# EAGLE board controller (EAGLE 8.2.1), part 1 of 2
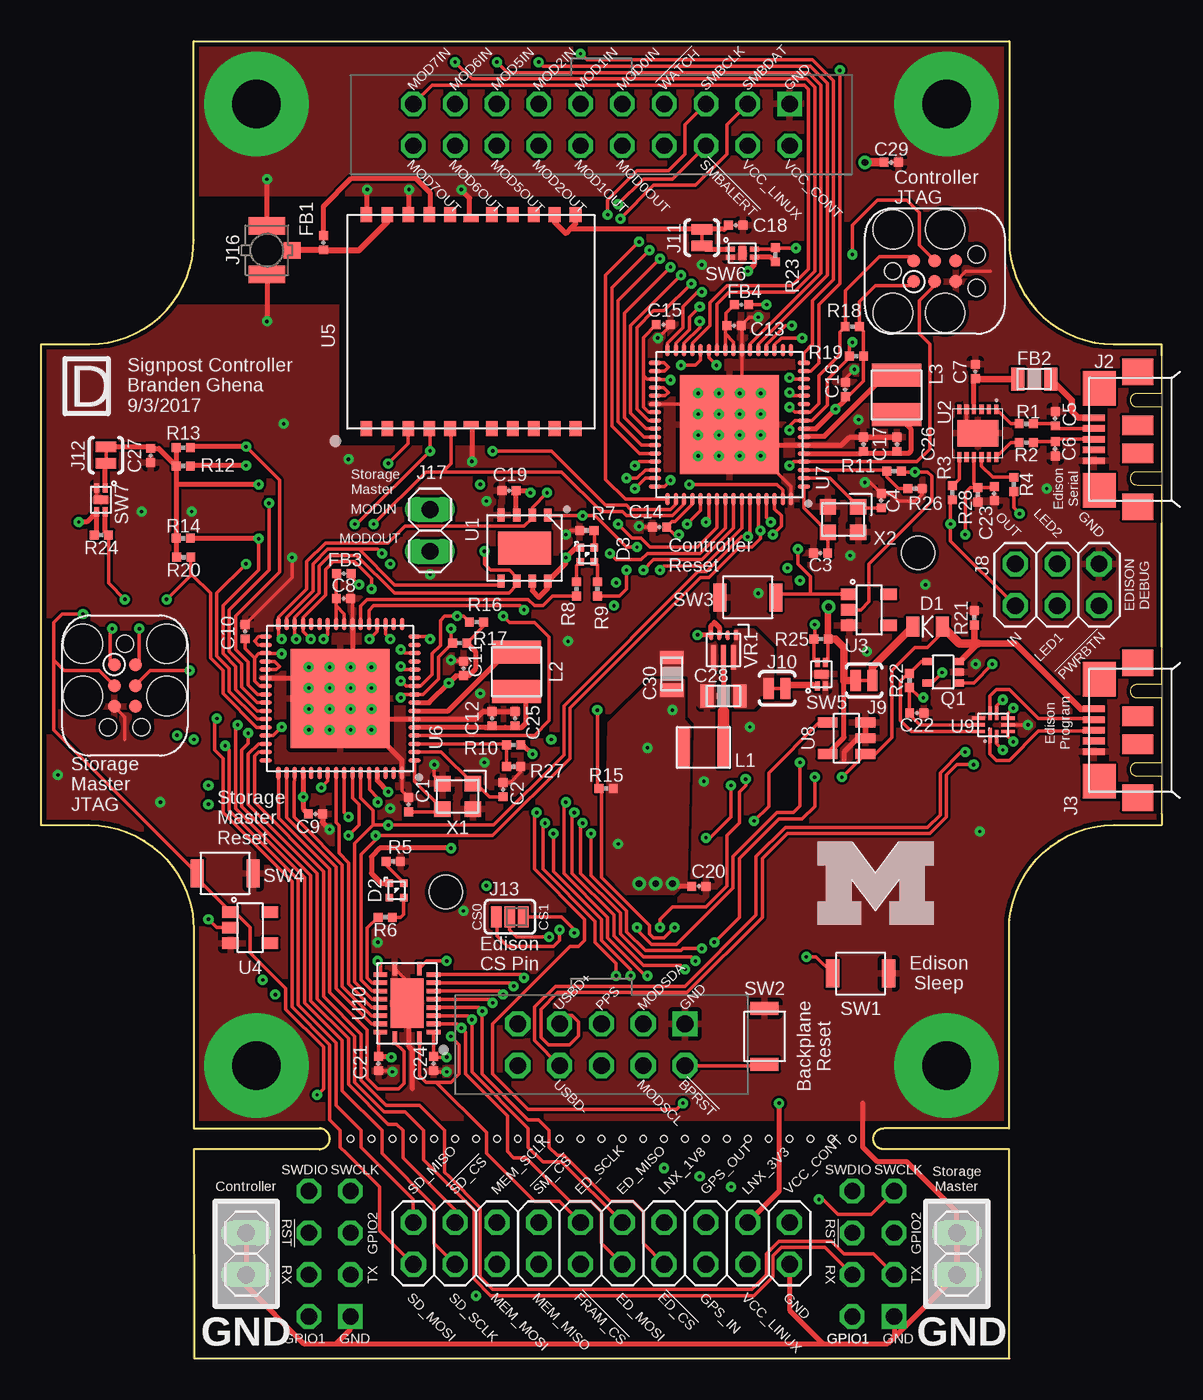
[diagram p5: board, top side]
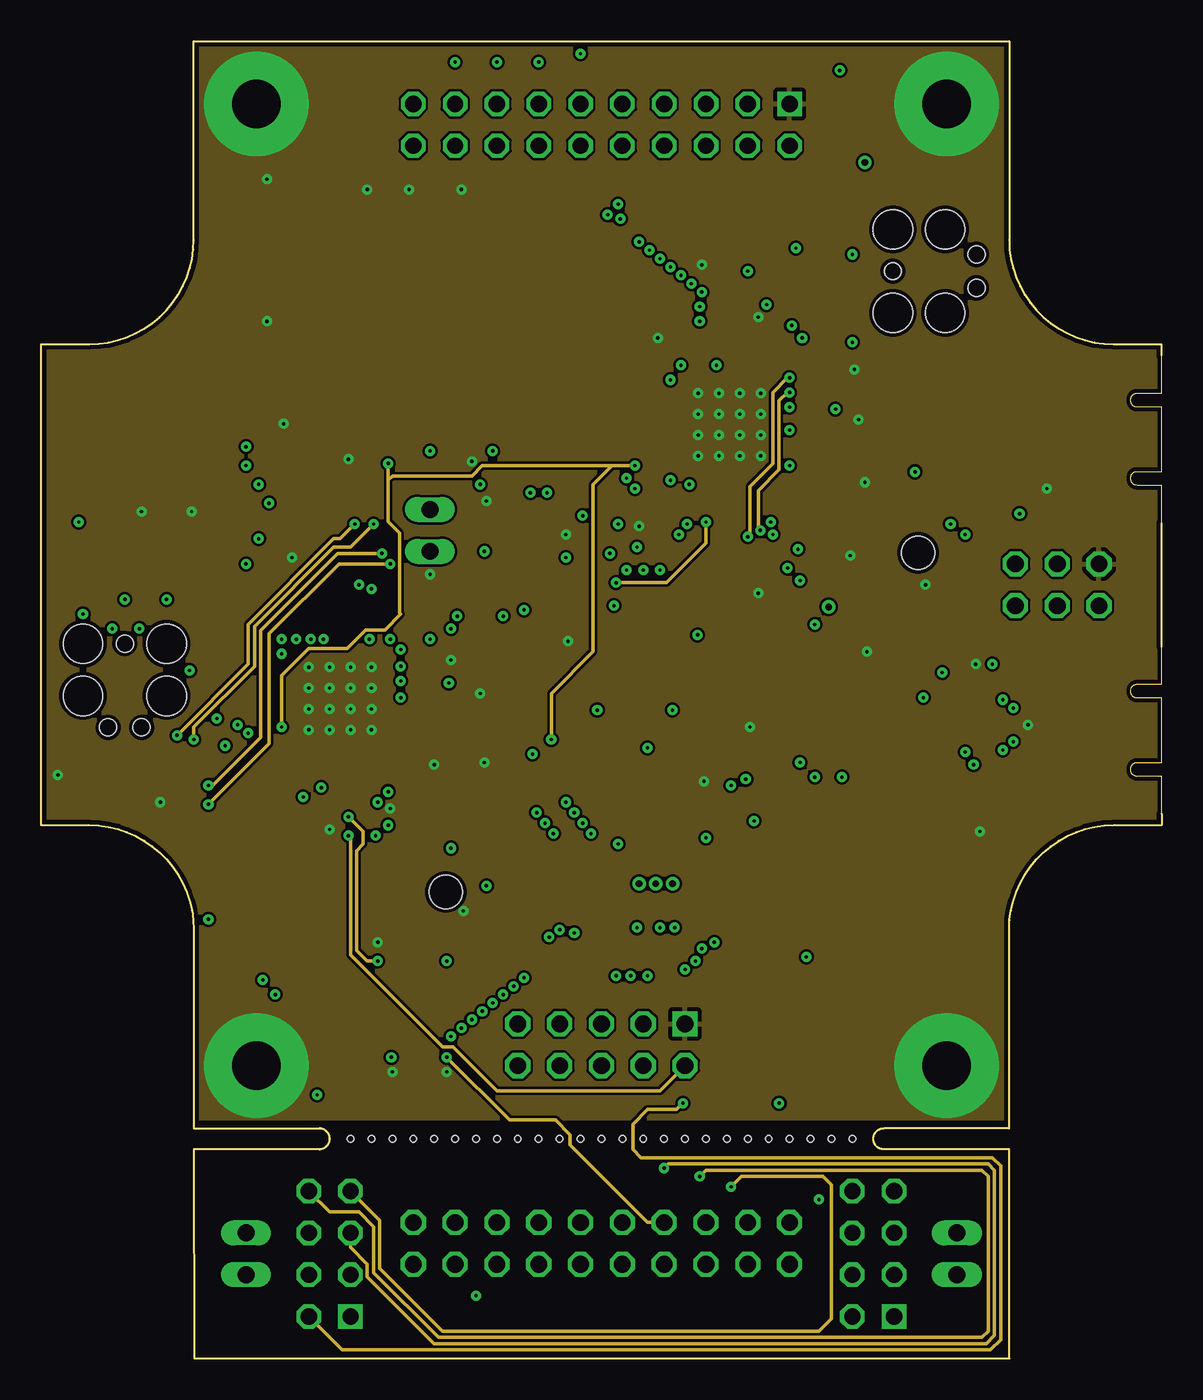
[diagram p6: board, inner layer Route2]
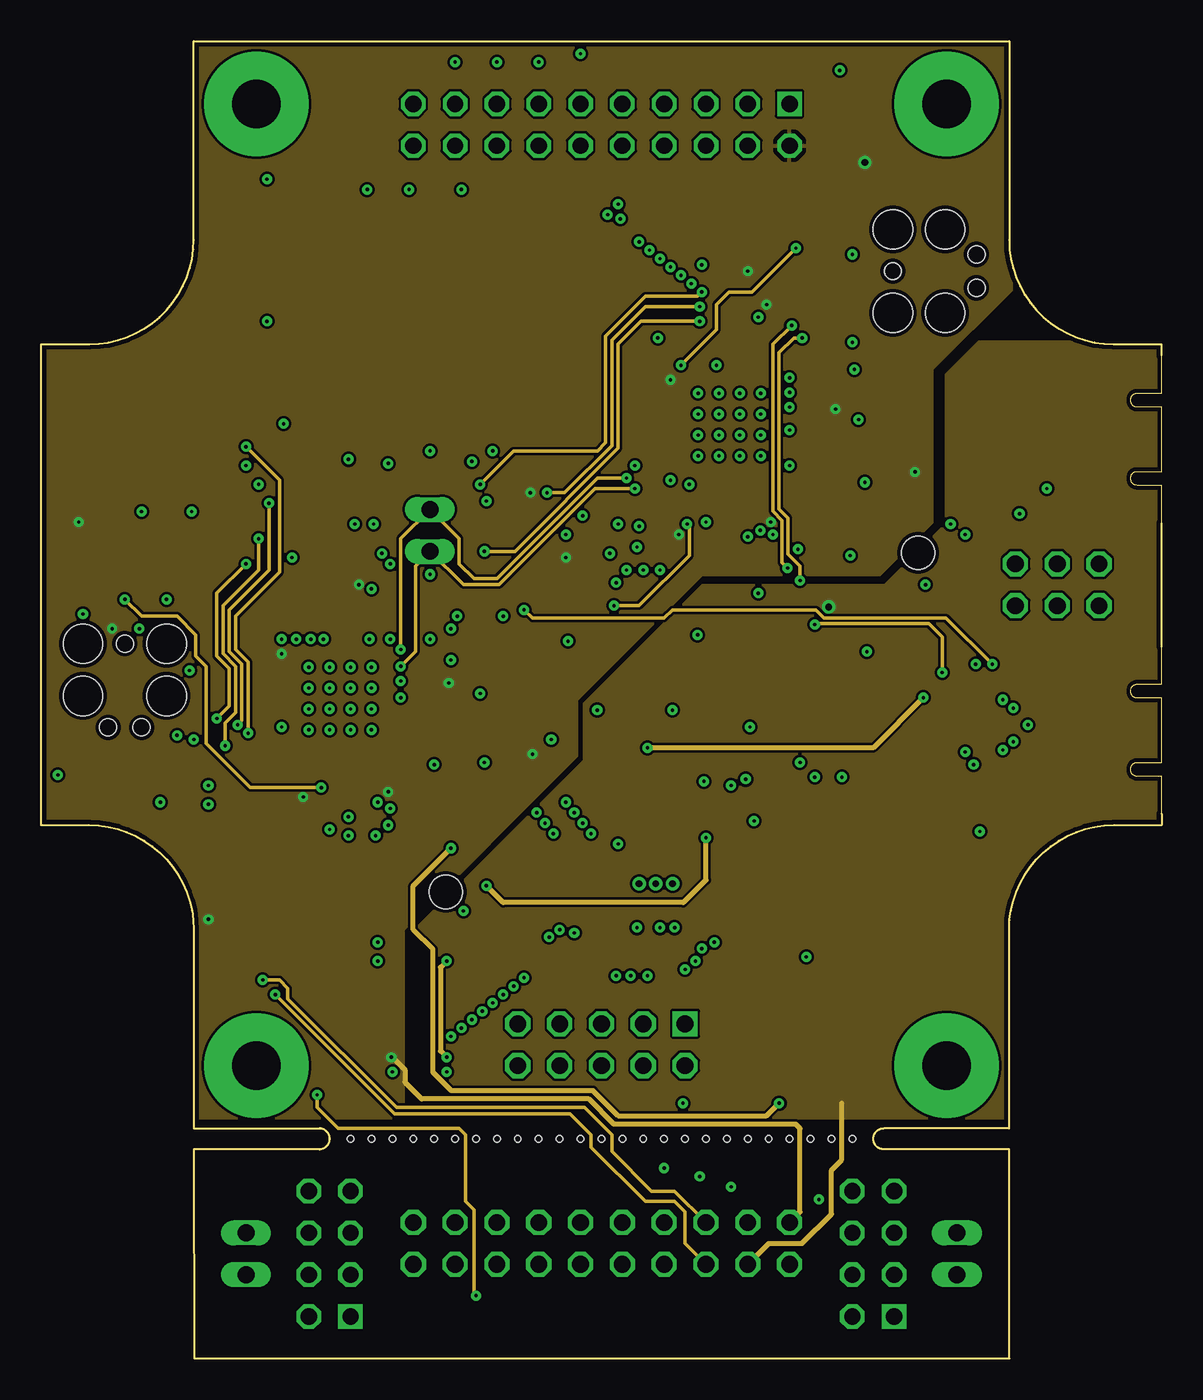
[diagram p7: board, inner layer Route15]
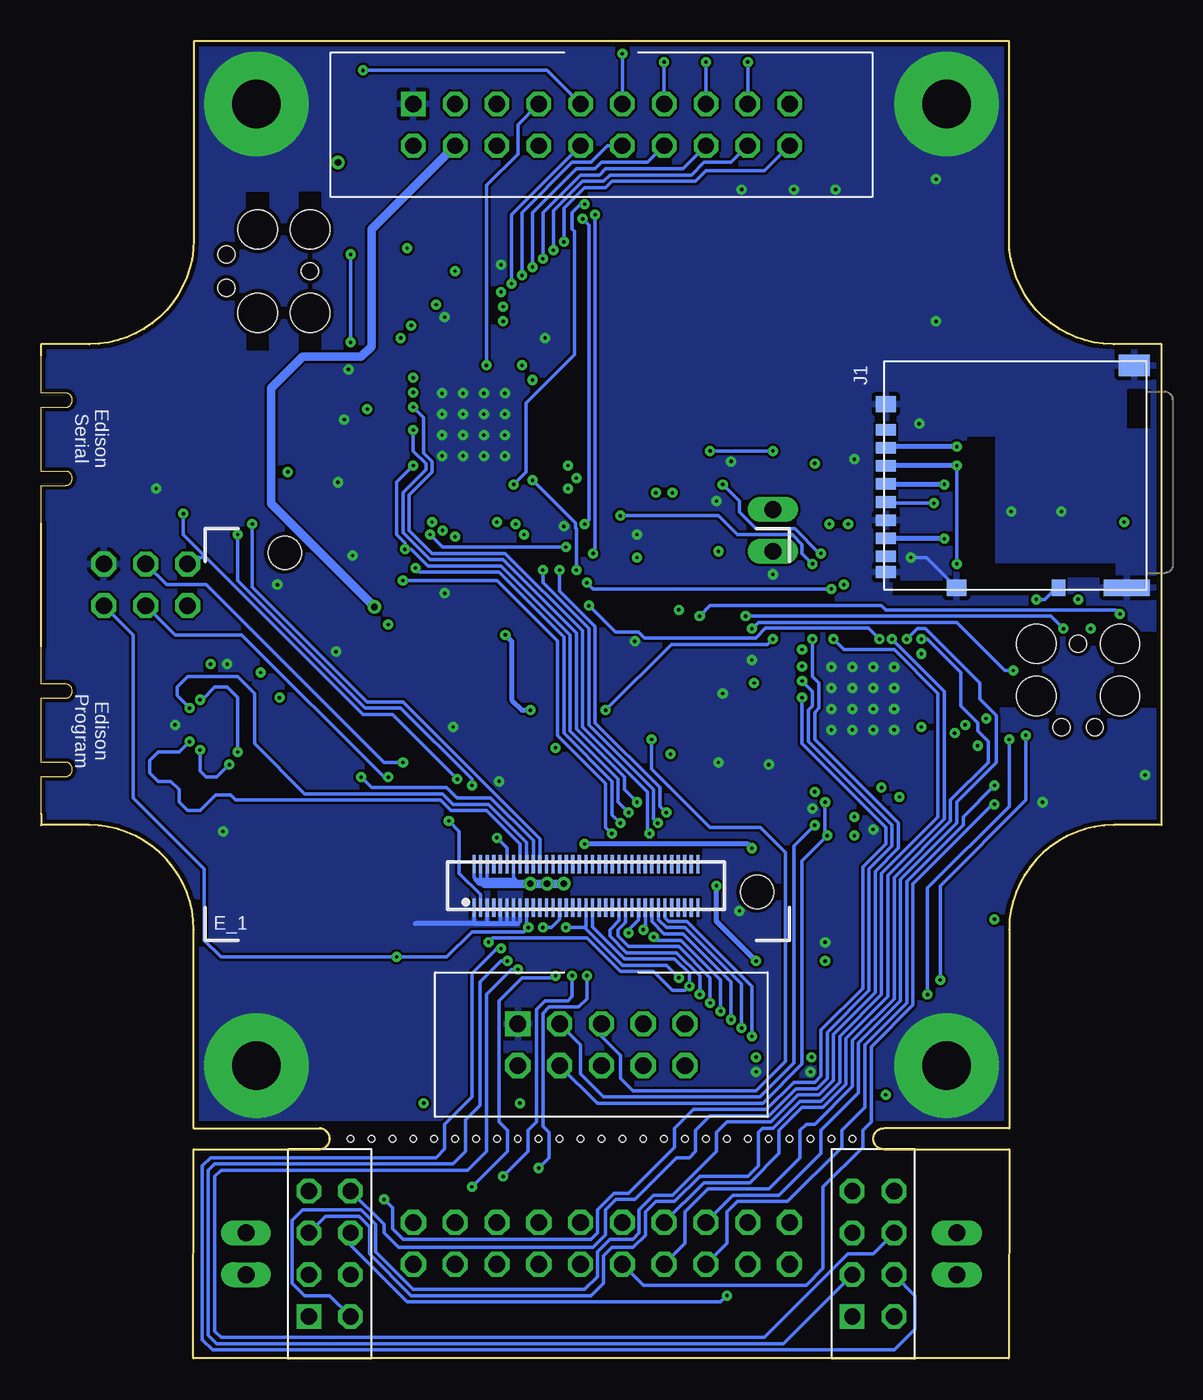
[diagram p8: board, bottom side, seen from below]

Size 68.07 x 80.01 mm. Coordinates in mm from the lower left corner, seen from the top.
Outline: 68.07,33.07 68.07,32.39 65.15,32.39 arc90 58.8,26.04 58.8,13.97 51.18,13.97 arc180 51.18,12.7 58.8,12.7 58.83,0 9.3,0 9.27,12.7 16.89,12.7 arc180 16.89,13.97 9.27,13.97 9.27,26.04 arc90 2.92,32.39 0,32.39 0,61.59 2.92,61.59 arc90 9.27,67.94 9.27,80.01 58.8,80.01 58.8,67.94 arc90 65.15,61.59 68.07,61.59 68.07,60.91
Outline: 68.07,43.23 68.07,50.72
Copper layers (1+2*15+16): Top 0.0178mm / dielectric 12mil / Route2 0.0356mm / dielectric 28mil / Route15 0.0356mm / dielectric 12mil / Bottom 0.0178mm
Design rules "sunstone-4lyr_v1.0.0.3 *": minimum track width 6mil, minimum drill 8mil, track to track 6mil, track to pad 6mil, pad to pad 6mil, via to via 6mil, smd to smd 6mil, copper to edge 10mil, drill to drill 16mil, minimum pad ring 8mil, minimum via ring 8mil, stop-mask expansion 3mil, vias tented up to drill 50mil, thermal gap 10mil

## Footprints (pad centres in the part's own frame; a part is rotated, then mirrored left to right if it is on the bottom)
0402_CAP = smd 0.536 x 0.546: 1 -0.433,0; 2 0.433,0
0805_CAP = smd 0.8 x 1.4: P$1 1,0; P$2 -1,0
0805_DIODE = smd 0.8 x 1.2: ANODE -0.9,0; CATHODE 0.9,0
1MM_SQ_4PAD = smd 0.457 x 0.457: 1 0.432,0.432; 2 0.432,-0.432; 3 -0.432,-0.432; 4 -0.432,0.432
EDISON_DAUGHTER = smd 1.14 x 0.2: 1 1.98,19.17; 2 4.62,19.17; 3 1.98,18.77; 4 4.62,18.77; 5 1.98,18.37; 6 4.62,18.37; 7 1.98,17.97; 8 4.62,17.97; 9 1.98,17.57; 10 4.62,17.57; 11 1.98,17.17; 12 4.62,17.17; 13 1.98,16.77; 14 4.62,16.77; 15 1.98,16.37; 16 4.62,16.37; 17 1.98,15.97; 18 4.62,15.97; 19 1.98,15.57; 20 4.62,15.57; 21 1.98,15.17; 22 4.62,15.17; 23 1.98,14.77; 24 4.62,14.77; 25 1.98,14.37; 26 4.62,14.37; 27 1.98,13.97; 28 4.62,13.97; 29 1.98,13.57; 30 4.62,13.57; 31 1.98,13.17; 32 4.62,13.17; 33 1.98,12.77; 34 4.62,12.77; 35 1.98,12.37; 36 4.62,12.37; 37 1.98,11.97; 38 4.62,11.97; 39 1.98,11.57; 40 4.62,11.57; 41 1.98,11.17; 42 4.62,11.17; 43 1.98,10.77; 44 4.62,10.77; 45 1.98,10.37; 46 4.62,10.37; 47 1.98,9.97; 48 4.62,9.97; 49 1.98,9.57; 50 4.62,9.57; 51 1.98,9.17; 52 4.62,9.17; 53 1.98,8.77; 54 4.62,8.77; 55 1.98,8.37; 56 4.62,8.37; 57 1.98,7.97; 58 4.62,7.97; 59 1.98,7.57; 60 4.62,7.57; 61 1.98,7.17; 62 4.62,7.17; 63 1.98,6.77; 64 4.62,6.77; 65 1.98,6.37; 66 4.62,6.37; 67 1.98,5.97; 68 4.62,5.97; 69 1.98,5.57; 70 4.62,5.57 | hole 2: 23.53,30.67; 2.93,1.98
DM3AT-SF-PEJM5 = smd 0.7 x 1.2: 1 3.2,-0.1; 2 2.1,-0.1; 3 1,-0.1; 4 -0.1,-0.1; 5 -1.2,-0.1; 6 -2.3,-0.1; 7 -3.4,-0.1; 8 -4.5,-0.1; B -5.45,-0.1 | smd 1 x 0.8: A -6.4,-10.6 | smd 1 x 1.2: MOUNT0 4.75,-0.1; MOUNT1 -6.4,-4.4 | smd 1 x 2.8: MOUNT2 -6.4,-14.75 | smd 1.3 x 1.9: MOUNT3 7.1,-15.2
USB_MICRO_B-HIROSE-ZX62R-B-5P = smd 0.4 x 1.35: 1 1.3,4.125; 2 0.65,4.125; 3 0,4.125; 4 -0.65,4.125; 5 -1.3,4.125 | smd 2.1 x 2: P$1 3.1,3.8; P$2 -3.1,3.8 | smd 1.6 x 1.9: P$3 -4.1,1.45; P$6 4.1,1.45 | smd 1.2 x 1.9: P$4 -0.85,1.45; P$5 0.85,1.45
MODULE_CONTROLLER = drill 0.991 square: 1 11.43,29.21; 100 -15.24,-44.45; 200 17.78,-44.45 | drill 0.991 octagon: 2 11.43,26.67; 3 8.89,29.21; 4 8.89,26.67; 5 6.35,29.21; 6 6.35,26.67; 7 3.81,29.21; 8 3.81,26.67; 9 1.27,29.21; 10 1.27,26.67; 11 -1.27,29.21; 12 -1.27,26.67; 13 -3.81,29.21; 14 -3.81,26.67; 15 -6.35,29.21; 16 -6.35,26.67; 17 -8.89,29.21; 18 -8.89,26.67; 19 -11.43,29.21; 20 -11.43,26.67; 101 -17.78,-44.45; 102 -15.24,-41.91; 103 -17.78,-41.91; 104 -15.24,-39.37; 105 -17.78,-39.37; 106 -15.24,-36.83; 107 -17.78,-36.83; 201 15.24,-44.45; 202 17.78,-41.91; 203 15.24,-41.91; 204 17.78,-39.37; 205 15.24,-39.37; 206 17.78,-36.83; 207 15.24,-36.83 | drill 1.016 square: 21 5.08,-26.67 | drill 1.016 octagon: 22 5.08,-29.21; 23 2.54,-26.67; 24 2.54,-29.21; 25 0,-26.67; 26 0,-29.21; 27 -2.54,-26.67; 28 -2.54,-29.21; 29 -5.08,-26.67; 30 -5.08,-29.21 | hole 0.381: 0,-33.655; 1.27,-33.655; -1.27,-33.655; 3.81,-33.655; 5.08,-33.655; 2.54,-33.655; -3.81,-33.655; -2.54,-33.655; -5.08,-33.655; 11.43,-33.655; 12.7,-33.655; 10.16,-33.655; 15.24,-33.655; 13.97,-33.655; 7.62,-33.655; 8.89,-33.655; 6.35,-33.655; -11.43,-33.655; -10.16,-33.655; -12.7,-33.655; -7.62,-33.655; -6.35,-33.655; -8.89,-33.655; -15.24,-33.655; -13.97,-33.655
1X02 = drill 1.016 long: 1 -1.27,0; 2 1.27,0
2X10 = drill 1.016 octagon: 1 -11.43,-1.27; 2 -11.43,1.27; 3 -8.89,-1.27; 4 -8.89,1.27; 5 -6.35,-1.27; 6 -6.35,1.27; 7 -3.81,-1.27; 8 -3.81,1.27; 9 -1.27,-1.27; 10 -1.27,1.27; 11 1.27,-1.27; 12 1.27,1.27; 13 3.81,-1.27; 14 3.81,1.27; 15 6.35,-1.27; 16 6.35,1.27; 17 8.89,-1.27; 18 8.89,1.27; 19 11.43,-1.27; 20 11.43,1.27
2X03 = drill 1.016 octagon: 1 -2.54,-1.27; 2 -2.54,1.27; 3 0,-1.27; 4 0,1.27; 5 2.54,-1.27; 6 2.54,1.27
SJ_2S-TRACE = smd 0.635 x 1.27: 1 -0.508,0; 2 0.508,0
SJ_3_PASTE2&3 = smd 0.635 x 1.27: 1 -0.813,0; 2 0,0; 3 0.813,0
TC2030-IDC = smd 0.787 x 0.787: 1 -1.27,-0.635; 2 -1.27,0.635; 3 0,-0.635; 4 0,0.635; 5 1.27,-0.635; 6 1.27,0.635 | hole 2.375: -2.54,2.54; 0.635,2.54; 0.635,-2.54; -2.54,-2.54 | hole 1.016: -2.54,0; 2.54,1.016; 2.54,-1.016
U.FL_SMT = smd 1.05 x 2.2: GND1 -1.475,0; GND2 1.475,0 | smd 1 x 1.05: SIG 0,-1.525
DFE322512C = smd 0.75 x 2.5: P$1 1.225,0; P$2 -1.225,0
1212 = smd 1.4 x 3: P$1 -1.2,0; P$2 1.2,0
SOT353 = smd 0.42 x 0.6: D1 0.65,-0.95; D2 -0.65,-0.95; G1 0.65,0.95; G2 -0.65,0.95; S 0,0.95
0402_RES = smd 0.536 x 0.546: 1 -0.433,0; 2 0.433,0
B3U-1000P = smd 0.8 x 1.7: 1 -1.7,0; 2 1.7,0
TDFN4 = smd 0.3 x 0.55: 1 -0.25,-0.725; 2 0.25,-0.725; 3 0.25,0.725; 4 -0.25,0.725 | smd 0.86 x 0.5: PAD 0,0
TDFN-8 = smd 0.45 x 0.8: 1 -1.425,-2.007; 2 -0.475,-2.007; 3 0.475,-2.007; 4 1.425,-2.007; 5 1.425,2.007; 6 0.475,2.007; 7 -0.475,2.007; 8 -1.425,2.007 | smd 3.2 x 2: NC 0,0
DFN-12/3MM = smd 0.6 x 0.25: 1 -1.45,1.13; 2 -1.45,0.68; 3 -1.45,0.23; 4 -1.45,-0.23; 5 -1.45,-0.68; 6 -1.45,-1.13; 7 1.45,-1.13; 8 1.45,-0.68; 9 1.45,-0.23; 10 1.45,0.23; 11 1.45,0.68; 12 1.45,1.13 | smd 1.6 x 2.5: 13 0,0
SOT23-5 = smd 0.7 x 1: 1 0.95,1.2; 2 0,1.2; 3 -0.95,1.2; 4 -0.95,-1.2; 5 0.95,-1.2
RXM-GPS-RM-T = smd 0.711 x 0.914: 1 -6.35,-6.502; 2 -5.08,-6.502; 3 -3.81,-6.502; 4 -2.54,-6.502; 5 -1.27,-6.502; 6 1.27,-6.502; 7 2.54,-6.502; 8 3.81,-6.502; 9 5.08,-6.502; 10 6.35,-6.502; 11 6.35,6.502; 12 5.08,6.502; 13 3.81,6.502; 14 2.54,6.502; 15 1.27,6.502; 16 -1.27,6.502; 17 -2.54,6.502; 18 -3.81,6.502; 19 -5.08,6.502; 20 -6.35,6.502 | smd 0.914 x 0.457: 21 0,-6.274; 22 0,6.274
QFN-64-9MM = smd 0.75 x 0.28: 1 -4.525,3.75; 2 -4.525,3.25; 3 -4.525,2.75; 4 -4.525,2.25; 5 -4.525,1.75; 6 -4.525,1.25; 7 -4.525,0.75; 8 -4.525,0.25; 9 -4.525,-0.25; 10 -4.525,-0.75; 11 -4.525,-1.25; 12 -4.525,-1.75; 13 -4.525,-2.25; 14 -4.525,-2.75; 15 -4.525,-3.25; 16 -4.525,-3.75; 33 4.525,-3.75; 34 4.525,-3.25; 35 4.525,-2.75; 36 4.525,-2.25; 37 4.525,-1.75; 38 4.525,-1.25; 39 4.525,-0.75; 40 4.525,-0.25; 41 4.525,0.25; 42 4.525,0.75; 43 4.525,1.25; 44 4.525,1.75; 45 4.525,2.25; 46 4.525,2.75; 47 4.525,3.25; 48 4.525,3.75 | smd 0.28 x 0.75: 17 -3.75,-4.525; 18 -3.25,-4.525; 19 -2.75,-4.525; 20 -2.25,-4.525; 21 -1.75,-4.525; 22 -1.25,-4.525; 23 -0.75,-4.525; 24 -0.25,-4.525; 25 0.25,-4.525; 26 0.75,-4.525; 27 1.25,-4.525; 28 1.75,-4.525; 29 2.25,-4.525; 30 2.75,-4.525; 31 3.25,-4.525; 32 3.75,-4.525; 49 3.75,4.525; 50 3.25,4.525; 51 2.75,4.525; 52 2.25,4.525; 53 1.75,4.525; 54 1.25,4.525; 55 0.75,4.525; 56 0.25,4.525; 57 -0.25,4.525; 58 -0.75,4.525; 59 -1.25,4.525; 60 -1.75,4.525; 61 -2.25,4.525; 62 -2.75,4.525; 63 -3.25,4.525; 64 -3.75,4.525 | smd 6 x 6: GND 0,0
SOT-23-5 = smd 0.6 x 1.2: 1 -0.95,-1.15; 2 0,-1.15; 3 0.95,-1.15; 4 0.95,1.15; 5 -0.95,1.15
UQFN-10 = smd 0.2 x 0.9: 1 -0.2,-0.65 | smd 0.2 x 0.8: 2 0.2,-0.7; 6 0.2,0.7; 7 -0.2,0.7 | smd 0.8 x 0.2: 3 0.9,-0.4; 4 0.9,0; 5 0.9,0.4; 8 -0.9,0.4; 9 -0.9,0; 10 -0.9,-0.4
R-PVQFN-N20 = smd 0.825 x 0.28: 1 -2.112,-0.75; 10 2.112,-0.75; 11 2.112,0.75; 20 -2.112,0.75 | smd 0.28 x 0.825: 2 -1.75,-1.613; 3 -1.25,-1.613; 4 -0.75,-1.613; 5 -0.25,-1.613; 6 0.25,-1.613; 7 0.75,-1.613; 8 1.25,-1.613; 9 1.75,-1.613; 12 1.75,1.613; 13 1.25,1.613; 14 0.75,1.613; 15 0.25,1.613; 16 -0.25,1.613; 17 -0.75,1.613; 18 -1.25,1.613; 19 -1.75,1.613 | smd 3 x 2: THERMAL 0,0
RLT0007A = smd 0.6 x 0.25: 1 -0.9,0.75; 2 -0.9,0.25; 3 -0.9,-0.25; 4 -0.9,-0.75 | smd 1.5 x 0.3: 5 0.45,-0.6; 6 0.45,0; 7 0.45,0.6
FHXXX = smd 1 x 0.95: 1 -0.925,-0.775; 2 0.925,-0.775; 3 0.925,0.775; 4 -0.925,0.775

## Placement (x,y rotation side)
C1  8pF  [0402_CAP]  22.33,33.63 90 top
C2  8pF  [0402_CAP]  28.07,34.54 90 top
C3  8pF  [0402_CAP]  47.35,48.92 180 top
C4  8pF  [0402_CAP]  51.03,52.1 90 top
C5  47pF  [0402_CAP]  61.59,57.07 90 top
C6  47pF  [0402_CAP]  61.59,55.25 270 top
C7  10nF  [0402_CAP]  56.75,59.94 90 top
C8  100nF  [0402_CAP]  18.36,46.15 0 top
C9  100nF  [0402_CAP]  16.66,33.07 0 top
C10  100nF  [0402_CAP]  12.4,44.15 90 top
C11  100nF  [0402_CAP]  25.65,41.91 90 top
C12  100nF  [0402_CAP]  27.38,38.86 90 top
C13  100nF  [0402_CAP]  42.09,62.74 0 top
C14  100nF  [0402_CAP]  37.57,50.5 180 top
C15  100nF  [0402_CAP]  37.8,62.79 0 top
C16  100nF  [0402_CAP]  48.84,58.85 90 top
C17  100nF  [0402_CAP]  49.96,55.52 90 top
C18  100nF  [0402_CAP]  42.19,68.83 0 top
C19  100nF  [0402_CAP]  28.42,52.7 180 top
C20  100nF  [0402_CAP]  39.95,28.68 0 top
C21  100nF  [0402_CAP]  20.49,17.91 90 top
C22  100nF  [0402_CAP]  53.19,39.19 0 top
C23  100nF  [0402_CAP]  57.89,52.53 270 top
C24  100nF  [0402_CAP]  23.84,17.91 90 top
C25  4.7uF  [0402_CAP]  28.78,38.86 90 top
C26  4.7uF  [0402_CAP]  51.99,55.52 90 top
C27  4.7uF  [0402_CAP]  6.65,54.84 270 top
C28  10uF  [0805_CAP]  41.45,40.23 0 top
C29  10uF  [0402_CAP]  51.64,72.64 0 top
C30  22uF  [0805_CAP]  38.3,41.58 270 top
D1  DIODE  [0805_DIODE]  53.85,44.45 180 top
D2  SML-LX0404SIUPGUSB  [1MM_SQ_4PAD]  21.59,28.42 90 top
D3  SML-LX0404SIUPGUSB  [1MM_SQ_4PAD]  33.17,48.82 90 top
E_1  EDISON_CONNECTOR_SEGMENTED  [EDISON_DAUGHTER]  22.61,25.4 90 bottom
FB1  300Ω  [0402_CAP]  17.15,67.77 270 top
FB2  600Ω  [0805_CAP]  60.33,59.49 180 top
FB3  1.5kΩ  [0402_CAP]  18.39,47.68 0 top
FB4  1.5kΩ  [0402_CAP]  42.55,64.01 0 top
J1  DM3AT-SF-PEJM5  [DM3AT-SF-PEJM5]  16.87,53.21 90 bottom
J2  MICRO_USB_B_HIROSE_ZX62R-B-5P  [USB_MICRO_B-HIROSE-ZX62R-B-5P]  68.07,55.83 90 top
J3  MICRO_USB_B_HIROSE_ZX62R-B-5P  [USB_MICRO_B-HIROSE-ZX62R-B-5P]  68.07,38.15 90 top
J4  MODULE_CONTROLLER  [MODULE_CONTROLLER]  34.04,46.99 0 top
J5  [1X02]  12.45,6.35 90 top
J6  [1X02]  55.63,6.35 90 top
J7  [2X10]  34.04,6.98 0 top
J8  [2X03]  61.72,46.99 180 top
J9  SOLDERJUMPERTRACE  [SJ_2S-TRACE]  49.99,41.17 0 top
J10  SOLDERJUMPERTRACE  [SJ_2S-TRACE]  44.7,40.69 180 top
J11  SOLDERJUMPERTRACE  [SJ_2S-TRACE]  40.13,68.07 90 top
J12  SOLDERJUMPERTRACE  [SJ_2S-TRACE]  3.94,54.86 90 top
J13  [SJ_3_PASTE2&3]  28.47,26.82 0 top
J14  TC2030-JLINK-L  [TC2030-IDC]  5.08,40.87 270 top
J15  TC2030-JLINK-L  [TC2030-IDC]  54.28,66.04 0 top
J16  U.FL-R-SMT  [U.FL_SMT]  13.72,67.31 90 top
J17  [1X02]  23.62,50.29 270 top
L1  0.47uH  [DFE322512C]  40.23,37.11 0 top
L2  22uH  [1212]  28.88,41.71 270 top
L3  22uH  [1212]  51.97,58.52 270 top
LOGO1  UMICH_SOLID_MEDIUM  [UMICH_SOLID_200MIL]  47.14,26.31 0 top
Q1  DMN32D2LDF  [SOT353]  54.79,41.68 270 top
R1  27Ω  [0402_RES]  59.84,56.77 180 top
R2  27Ω  [0402_RES]  59.84,55.63 180 top
R3  100Ω  [0402_RES]  55.36,52.58 270 top
R4  100Ω  [0402_RES]  59.08,53.09 270 top
R5  1kΩ  [0402_RES]  21.39,30.18 0 top
R6  1kΩ  [0402_RES]  20.9,26.8 180 top
R7  1kΩ  [0402_RES]  33.15,50.29 180 top
R8  1kΩ  [0402_RES]  32.51,46.74 270 top
R9  1kΩ  [0402_RES]  33.78,46.74 270 top
R10  10kΩ  [0402_RES]  28.7,37.26 0 top
R11  10kΩ  [0402_RES]  51.82,53.9 0 top
R12  10kΩ  [0402_RES]  8.64,54.21 180 top
R13  10kΩ  [0402_RES]  8.64,55.31 180 top
R14  10kΩ  [0402_RES]  8.64,49.81 180 top
R15  10kΩ  [0402_RES]  34.32,34.62 0 top
R16  100kΩ  [0402_RES]  26.44,44.73 0 top
R17  100kΩ  [0402_RES]  25.43,43.46 0 top
R18  100kΩ  [0402_RES]  49.28,62.66 0 top
R19  100kΩ  [0402_RES]  49.53,60.88 0 top
R20  100kΩ  [0402_RES]  8.66,48.66 180 top
R21  100kΩ  [0402_RES]  56.69,44.98 90 top
R22  100kΩ  [0402_RES]  52.76,41.17 90 top
R23  1MΩ  [0402_RES]  44.6,67.03 270 top
R24  1MΩ  [0402_RES]  3.66,50.01 180 top
R25  1MΩ  [0402_RES]  47.37,43.69 0 top
R26  DNP  [0402_RES]  53.09,52.83 180 top
R27  DNP  [0402_RES]  28.7,35.94 180 top
R28  100kΩ  [0402_RES]  56.9,52.45 270 top
SW1  B3U-1000P  [B3U-1000P]  49.78,23.37 0 top
SW2  B3U-1000P  [B3U-1000P]  43.94,19.56 90 top
SW3  B3U-1000P  [B3U-1000P]  42.93,46.23 180 top
SW4  B3U-1000P  [B3U-1000P]  11.18,29.46 0 top
SW5  SIP3240X  [TDFN4]  47.4,41.55 0 top
SW6  SIP3240X  [TDFN4]  42.6,67.13 270 top
SW7  SIP3240X  [TDFN4]  3.63,52.15 180 top
U1  FM25CLXXB-DG  [TDFN-8]  29.36,49.23 180 top
U2  FTDI234XD  [DFN-12/3MM]  56.9,56.2 270 top
U3  NCP301LSN30  [SOT23-5]  50.29,45.47 90 top
U4  NCP301LSN30  [SOT23-5]  12.7,26.16 90 top
U5  RXM-GPS-RM-T  [RXM-GPS-RM-T]  26.11,62.97 0 top
U6  SAM4LC8BA  [QFN-64-9MM]  18.16,40.08 180 top
U7  SAM4LC8BA  [QFN-64-9MM]  41.81,56.72 180 top
U8  SN74LVC1G125DBVR  [SOT-23-5]  48.92,37.67 90 top
U9  TS3USB30E  [UQFN-10]  57.84,38.48 0 top
U10  TXS0108EVQFN20  [R-PVQFN-N20]  22.23,21.56 90 top
VR1  TPS62086  [RLT0007A]  41.45,43.03 270 top
X1  16MHz  [FHXXX]  25.3,34.14 180 top
X2  16MHz  [FHXXX]  48.72,50.95 180 top